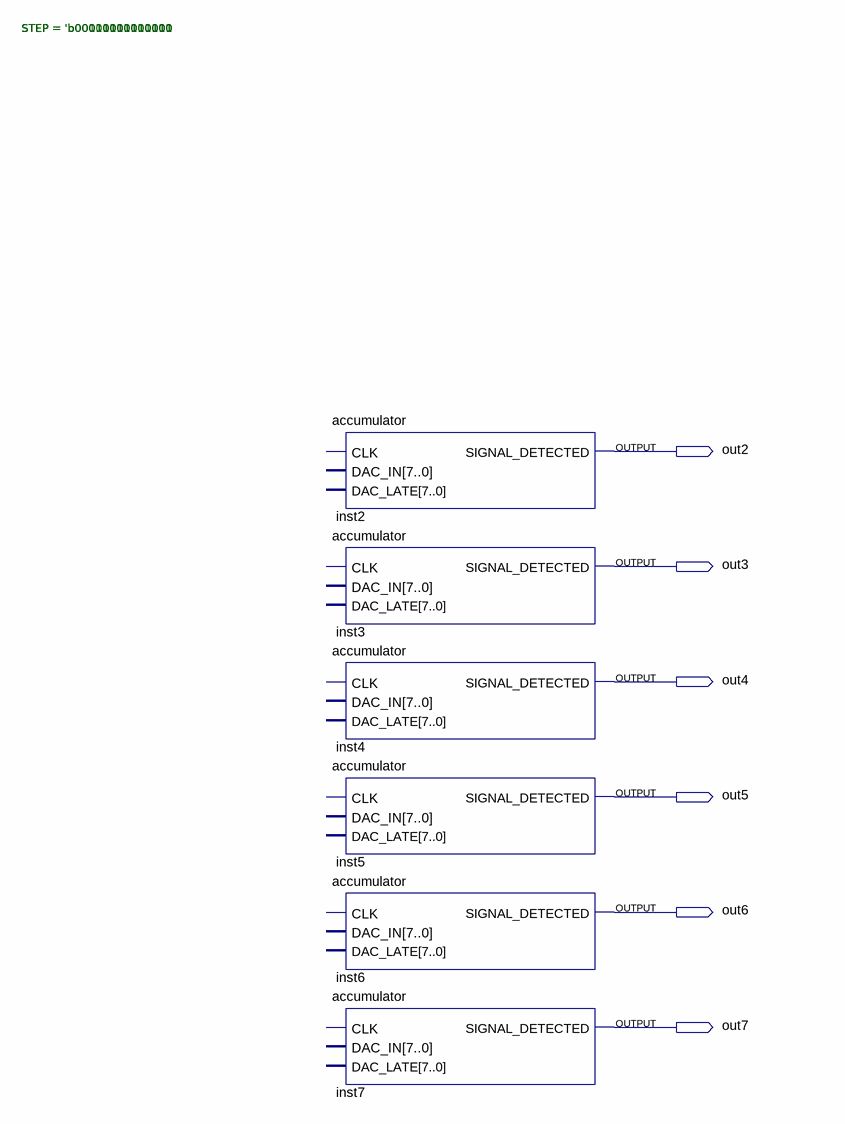
[diagram p0: schematic sheet]
// Quartus schematic temp.bdf as structural Verilog: 6 symbols, 6 pins
module temp (
  output out2,
  output out3,
  output out4,
  output out5,
  output out6,
  output out7
);

  accumulator #(.STEP('b00010001111000)) inst2 (.SIGNAL_DETECTED(out2));  // open: CLK, DAC_IN, DAC_LATE
  accumulator #(.STEP('b00010011110010)) inst3 (.SIGNAL_DETECTED(out3));  // open: CLK, DAC_IN, DAC_LATE
  accumulator #(.STEP('b00010101110110)) inst4 (.SIGNAL_DETECTED(out4));  // open: CLK, DAC_IN, DAC_LATE
  accumulator #(.STEP('b00011100000101)) inst5 (.SIGNAL_DETECTED(out5));  // open: CLK, DAC_IN, DAC_LATE
  accumulator #(.STEP('b00011111000001)) inst6 (.SIGNAL_DETECTED(out6));  // open: CLK, DAC_IN, DAC_LATE
  accumulator #(.STEP('b00100010010011)) inst7 (.SIGNAL_DETECTED(out7));  // open: CLK, DAC_IN, DAC_LATE
endmodule
